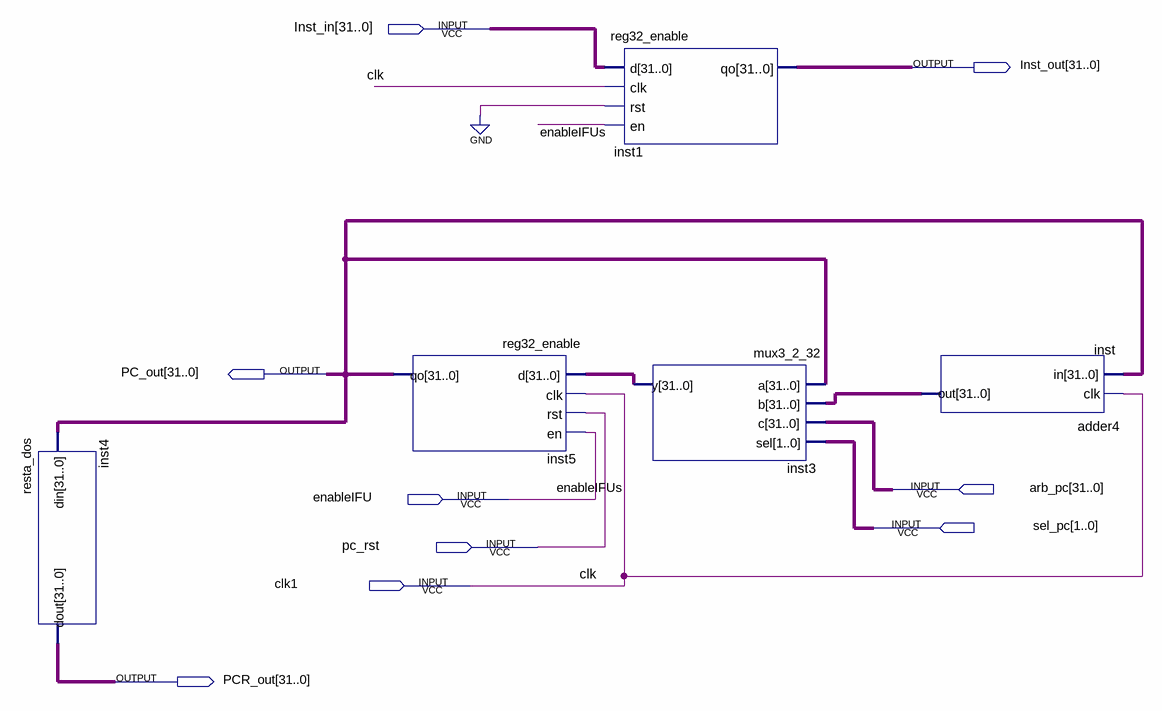
[diagram p0: schematic sheet]
// Quartus schematic IFU.bdf as structural Verilog: 5 symbols, 9 pins
module IFU (
  input  [31:0] Inst_in,
  input  [31:0] arb_pc,
  input  enableIFU,
  input  [1:0] sel_pc,
  input  pc_rst,
  input  clk1,
  output [31:0] Inst_out,
  output [31:0] PC_out,
  output [31:0] PCR_out
);

  wire [31:0] inst3_y, inst_out_2;

  resta_dos inst4 (.din(PC_out), .dout(PCR_out));
  reg32_enable inst5 (.d(inst3_y), .clk(clk1), .rst(pc_rst), .en(enableIFU), .qo(PC_out));
  reg32_enable inst1 (.d(Inst_in), .clk(clk1), .rst(1'b0), .en(enableIFU), .qo(Inst_out));
  mux3_2_32 inst3 (.a(PC_out), .b(inst_out_2), .c(arb_pc), .sel(sel_pc), .y(inst3_y));
  adder4 inst (.clk(clk1), .in(PC_out), .out(inst_out_2));

  // Other names for the same wires on the sheet: clk = clk1; enableIFUs = enableIFU
endmodule
